# Altium project ThrusterBoard.PrjPcb
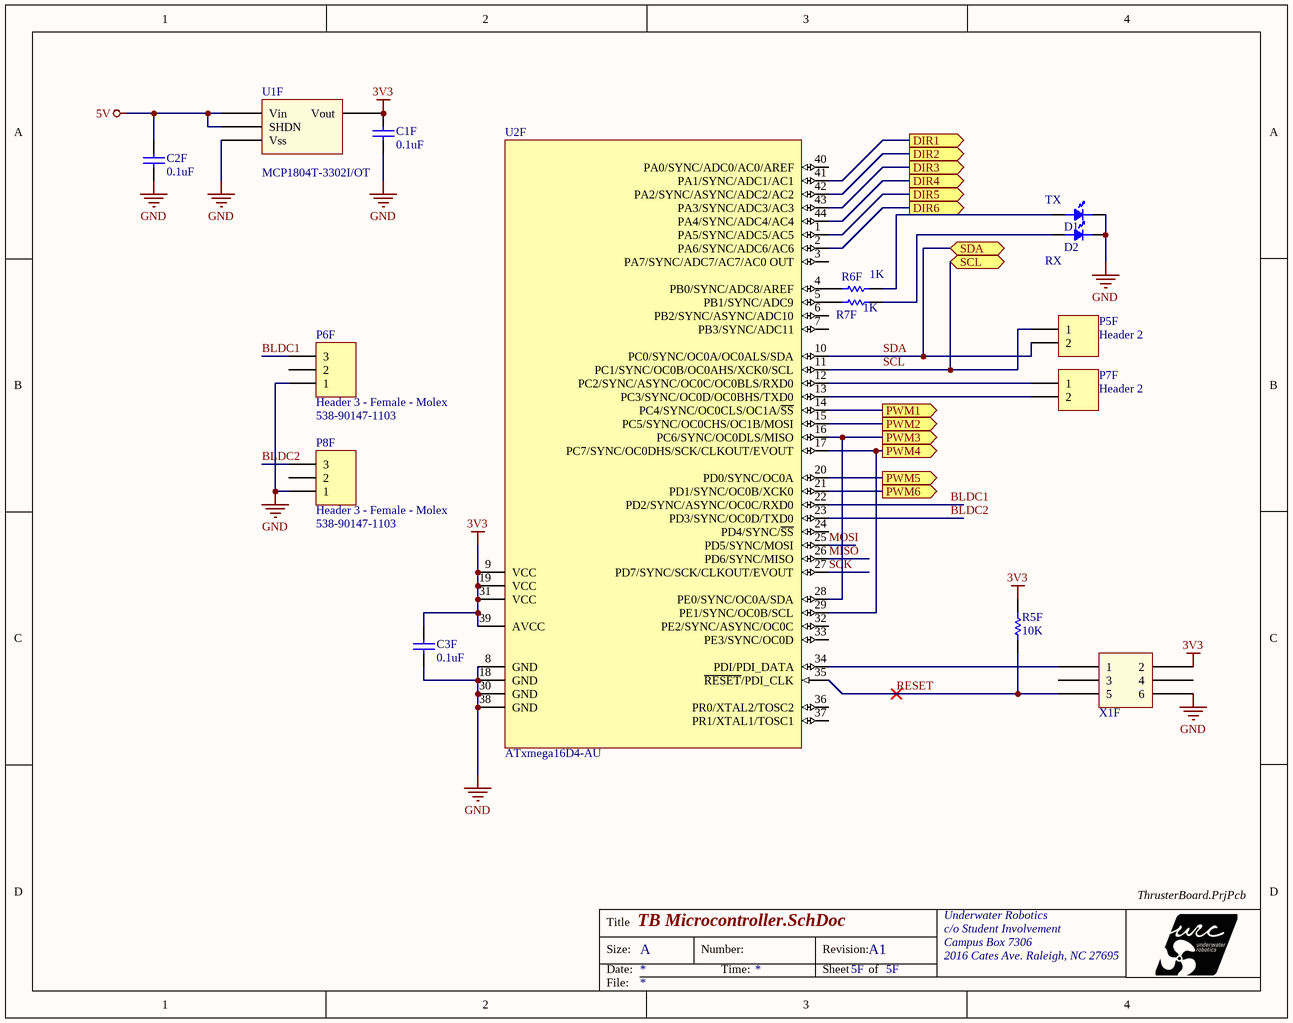
[diagram p0: TB Microcontroller.SchDoc]
1 sheet, 15 parts. Net scope: flat (ports and power ports of the same name join across sheets).
Board file: ThrusterBoard.PcbDoc

## Sheet TB Microcontroller.SchDoc
size A; Organization: Underwater Robotics; Address1: c/o Student Involvement; Address2: Campus Box 7306; Address3: 2016 Cates Ave. Raleigh, NC 27695; Revision: A1; SheetNumber: 5F; SheetTotal: 5F

### Parts
C1F  value 0.1uF  [C0603]  (hidden comment: 0.1uF, C0603, MultiComp)
C2F  value 0.1uF  [C0603]  (hidden comment: 0.1uF, C0603, MultiComp)
C3F  value 0.1uF  [C0603]  (hidden comment: 0.1uF, C0603, MultiComp)
D1  LED  [LED0805]  (value not drawn)
D2  LED  [LED0805]  (value not drawn)
P5F  Header 2  [HDR1X2]
P6F  Header 3 - Female - Molex  Supplier Part Number 1: 538-90147-1103  [HDR1X3 - Female - Molex]
P7F  Header 2  [HDR1X2]
P8F  Header 3 - Female - Molex  Supplier Part Number 1: 538-90147-1103  [HDR1X3 - Female - Molex]
R5F  value 10K  [R0603]  (hidden comment: Resistor)
R6F  value 1K  [R0603]  (hidden comment: Resistor)
R7F  value 1K  [R0603]  (hidden comment: Resistor)
U1F  MCP1804T-3302I/OT  [MCP1804T-3302I/OT]
U2F  ATxmega16D4-AU  [44A_N]
X1F  Header  [2x3 Header]  (value not drawn)

### Ports
DIR1 (out), DIR2 (out), DIR3 (out), DIR4 (out), DIR5 (out), DIR6 (out), PWM1 (out), PWM2 (out), PWM3 (out), PWM4 (out), PWM5 (out), PWM6 (out), SCL (bidir), SDA (bidir)

### Nets
3V3: C1F.1(+) C3F.1(+) R5F.2 U1F.Vout U2F.9(VCC) U2F.19(VCC) U2F.31(VCC) U2F.39(AVCC) X1F.2
5V: C2F.1(+) U1F.SHDN U1F.Vin
GND: C1F.2 C2F.2 C3F.2 D1.1 D2.1 P6F.1 P8F.1 U1F.Vss U2F.8(GND) U2F.18(GND) U2F.30(GND) U2F.38(GND) X1F.6
BLDC1: P6F.3 U2F.22(PD2/SYNC/ASYNC/OC0C/RXD0)
BLDC2: P8F.3 U2F.23(PD3/SYNC/OC0D/TXD0)
MISO: U2F.26(PD6/SYNC/MISO)
MOSI: U2F.25(PD5/SYNC/MOSI)
RESET: R5F.1 U2F.35(~{RESET}/PDI_CLK) X1F.5
SCK: U2F.27(PD7/SYNC/SCK/CLKOUT/EVOUT)
SCL: P5F.1 U2F.11(PC1/SYNC/OC0B/OC0AHS/XCK0/SCL) ; port SCL
SDA: P5F.2 U2F.10(PC0/SYNC/OC0A/OC0ALS/SDA) ; port SDA
NetD1_2: D1.2 R6F.2
NetD2_2: D2.2 R7F.2
NetP7F_1: P7F.1 U2F.12(PC2/SYNC/ASYNC/OC0C/OC0BLS/RXD0)
NetP7F_2: P7F.2 U2F.13(PC3/SYNC/OC0D/OC0BHS/TXD0)
NetR6F_1: R6F.1 U2F.4(PB0/SYNC/ADC8/AREF)
NetR7F_1: R7F.1 U2F.5(PB1/SYNC/ADC9)
NetU2F_1: U2F.1(PA5/SYNC/ADC5/AC5) ; port DIR5
NetU2F_2: U2F.2(PA6/SYNC/ADC6/AC6) ; port DIR6
NetU2F_14: U2F.14(PC4/SYNC/OC0CLS/OC1A/~{SS}) ; port PWM1
NetU2F_15: U2F.15(PC5/SYNC/OC0CHS/OC1B/MOSI) ; port PWM2
NetU2F_16: U2F.16(PC6/SYNC/OC0DLS/MISO) U2F.28(PE0/SYNC/OC0A/SDA) ; port PWM3
NetU2F_17: U2F.17(PC7/SYNC/OC0DHS/SCK/CLKOUT/EVOUT) U2F.29(PE1/SYNC/OC0B/SCL) ; port PWM4
NetU2F_20: U2F.20(PD0/SYNC/OC0A) ; port PWM5
NetU2F_21: U2F.21(PD1/SYNC/OC0B/XCK0) ; port PWM6
NetU2F_34: U2F.34(PDI/PDI_DATA) X1F.1
NetU2F_41: U2F.41(PA1/SYNC/ADC1/AC1) ; port DIR1
NetU2F_42: U2F.42(PA2/SYNC/ASYNC/ADC2/AC2) ; port DIR2
NetU2F_43: U2F.43(PA3/SYNC/ADC3/AC3) ; port DIR3
NetU2F_44: U2F.44(PA4/SYNC/ADC4/AC4) ; port DIR4

Not connected (* = marked no-connect by the designer): P6F 2; P8F 2; U2F 3(PA7/SYNC/ADC7/AC7/AC0_OUT) 6(PB2/SYNC/ASYNC/ADC10) 7(PB3/SYNC/ADC11) 24(PD4/SYNC/~{SS}) 32(PE2/SYNC/ASYNC/OC0C) 33(PE3/SYNC/OC0D) 36(PR0/XTAL2/TOSC2) 37(PR1/XTAL1/TOSC1) 40(PA0/SYNC/ADC0/AC0/AREF); X1F 3 4

### Notes on the sheet
- (near D1) TX
- (near D2) RX
- Title
- Size:
- Date:
- A
- Number:
- Time:
- Revision:
- Sheet
- of
- File:

### Library data of the parts
C1F C2F C3F = 0.1uF, C0603, MultiComp: Ceramic MLCC, Multicompo, X7R Dielectric; Manufacturer Part Number: MC0603B104K500CT; Description 1: MULTICOMP - MC0603B104K500CT - CERAMIC CAPACITOR, 0.1UF, 50V, X7R, 10%, 0603; Product Range: MC Series; Capacitance: 0.1 F; Capacitance Tolerance: 10%; Dielectric Characteristic: X7; Voltage Rating: 50; Ceramic Capacitor Case: 0603 [1608 Metric]; Supplier 1: Newark; Supplier Part Number 1: 06R4927; Manufacturer 1: MULTICOMP; RoHS: YES; Stock 1: 166516; Pricing 1: 1=0.075, 10=0.048, 50=0.027, 100=0.021, 250=0.017, 500=0.015, 1000=0.012 (USD); Packaging: Cut Tape; ComponentLink1URL: http://www.farnell.com/datasheets/1522998.pdf; ComponentLink1Description: http://www.farnell.com/datasheets/1522998.pdf; ComponentLink2URL: /pdfs/datasheets/spc/Ta-1098.pdf; ComponentLink2Description: /pdfs/datasheets/spc/Ta-1098.pdf
P5F P7F = Header 2: Header, 2-Pin; LatestRevisionDate: 17-Jul-2002; LatestRevisionNote: Re-released for DXP Platform.; Publisher: Altium Limited
P6F P8F = Header 3 - Female - Molex: Header, 3-Pin; Manufacturer Part Number: 90147-1103; Current Rating: 3 A; Mounting Angle: Vertical; Number of Positions: 3 Position; Voltage Rating: 350 V; Pitch: 2.54 mm; Supplier 1: Mouser; Manufacturer: Molex; RoHS: RoHS Compliant; Category: Headers & Wire Housings; Stock 1: 5207; Pricing 1: 1=1.26, 100=1.09, 500=0.988, 1000=0.895, 2000=0.734, 5000=0.575, 10000=0.490 (AUD); Accessory Type: -; Contact Plating: Tin; Contact Type: -; Housing Material: Polyester; Number of Rows: 1 Row; Packaging: Tube; Product: Headers; Series: 90147; Termination Style: Through Hole; Type: Socket; Brand: Molex; Contact Material: Phosphor Bronze; Mounting Style: Through Hole; Row Spacing: -; Contact Gender: Socket (Female); Housing Gender: -; Product Category: C-Grid Connectors; Standard Pack Qty: 5760; Tradename: C-Grid; RoHS - Mouser: Y; Minimum Order Quantity: 1; Reeling: False; ComponentLink1URL: http://www.mouser.com/ds/2/276/0901471103_PCB_RECEPTACLES-176816.pdf; ComponentLink1Description: http://www.mouser.com/ds/2/276/0901471103_PCB_RECEPTACLES-176816.pdf
R5F = 10k, 1%, 100mW, Yageo, R0603: Manufacturer 1: YAGEO; Manufacturer Part Number: RC0603FR-1010KL; Tolerance: 1%; Description 1: YAGEO - RC0603FR-1010KL - RES, THICK FILM, 10K, 1%, 0.1W, 0603; Product Range: RC Series; Resistance: 10; Power Rating: 100; Voltage Rating: 50; Resistor Case Style: 0603 [1608 Metric]; Body Length: 1.6; Supplier 1: Newark; Supplier Part Number 1: 68R0120; RoHS: YESX; Stock 1: 7839; Pricing 1: 1=0.002, 10=0.002, 25=0.002, 100=0.002, 250=0.002, 1000=0.002 (USD); Resistance Tolerance: 1%; Packaging: Cut Tape; MSL: -; ComponentLink1URL: http://www.farnell.com/datasheets/1868787.pdf; ComponentLink1Description: http://www.farnell.com/datasheets/1868787.pdf; ComponentLink2URL: http://www.yageo.com/pdf/PYu-RC0603_51_RoHS_L_4.pdf; ComponentLink2Description: http://www.yageo.com/pdf/PYu-RC0603_51_RoHS_L_4.pdf
R6F R7F = 1k, 5%, 100mW, Yageo, R0603: Manufacturer 1: YAGEO; Manufacturer Part Number: RC0603JR-131KL; Tolerance: 5%; Description 1: YAGEO - RC0603JR-131KL - RES, THICK FILM, 1K, 5%, 0.1W, 0603; Product Range: RC Series; Resistance: 1; Power Rating: 100; Voltage Rating: 50; Resistor Case Style: 0603 [1608 Metric]; Body Height: 0.45; Supplier 1: Newark; Supplier Part Number 1: 68R0220; RoHS: YESX; Stock 1: 36430; Pricing 1: 1=0.06, 10=0.011, 25=0.008, 100=0.005, 250=0.003, 1000=0.002 (USD); Resistance Tolerance: 5%; Packaging: Cut Tape; MSL: -; ComponentLink1URL: http://www.farnell.com/datasheets/1868787.pdf; ComponentLink1Description: http://www.farnell.com/datasheets/1868787.pdf; ComponentLink2URL: http://www.yageo.com/pdf/PYu-RC0603_51_RoHS_L_4.pdf; ComponentLink2Description: http://www.yageo.com/pdf/PYu-RC0603_51_RoHS_L_4.pdf
U1F = MCP1804T-3302I/OT: 3.3V Linear Regulator; Manufacturer 1: MICROCHIP; Description 1: MICROCHIP - MCP1804T-3302I/OT - LDO VOLTAGE REGULATOR, 3.3V, 150mA, 5-SOT-23; Input Voltage Min: 2; Input Voltage Max: 28; Output Current: 150; Dropout Voltage Vdo: 260; LDO Regulator Case Style: SOT-23; No. of Pins: 5; URL: http://www.newark.com/microchip/mcp1804t-3302i-ot/ldo-voltage-regulator-3-3v-150ma/dp/55R1047; Supplier 1: Newark; Supplier Part Number 1: 55R1047; RoHS: YES; Stock 1: 12; Pricing 1: 1=0.67, 26=0.56, 100=0.51 (USD); Operating Temperature Min: -40 C; ComponentLink1URL: http://www.farnell.com/datasheets/1789199.pdf; ComponentLink1Description: http://www.farnell.com/datasheets/1789199.pdf; ComponentLink2URL: http://www.farnell.com/cad/1790647.zip; ComponentLink2Description: http://www.farnell.com/cad/1790647.zip; Manufacturer Part Number: MCP1804T-3302I/OT
U2F = ATxmega16D4-AU: 8/16-bit AVR XMEGA D4 Microcontroller, 1.6-3.6V, 32MHz, 16KB + 4KB Flash, 1KB EEPROM, 2KB SRAM, 44-pin TQFP, Industrial Grade (-40°C to 85°C), Pb-Free; Manufacturer 1: ATMEL; Description 1: ATMEL - ATXMEGA16D4-AU - MICROCONTROLLER MCU, 8 BIT, AVR XMEGA, 32MHZ, TQFP-44; CPU Speed: 32; Program Memory Size: 16; RAM Memory Size: 2; No. of Pins: 44; No. of I/O's: 34; Supply Voltage Min: 1.6; DatasheetVersion: revJ, Dec-2010; PackageVersion: revC, Oct-2010; PackageReference: 44A; PackageDescription: 44-Pin Plastic Thin Profile Quad Flat Pack, 10 x 10 x 1.0 mm Body, 0.8 mm Pitch (TQFP); Code_JEDEC: MS-026-ACB; ComponentLink1Description: Manufacturer URL; ComponentLink1URL: http://www.atmel.com/; ComponentLink2Description: ATxmega128D4/64D4/32D4/16D4 Datasheet; ComponentLink2URL: http://www.atmel.com/dyn/resources/prod_documents/doc8135.pdf; Supplier 1: Newark; Supplier Part Number 1: 68T3906; Manufacturer Part Number: ATXMEGA16D4-AU; RoHS: YES; Stock 1: 196; Pricing 1: 1=2.71, 10=2.38, 25=2.24, 50=1.9, 100=1.79, 250=1.72, 500=1.69, 1000=1.49 (USD); Controller Family/Series: ATxmega; MCU Case Style: TQFP; ComponentLink3URL: http://www.farnell.com/datasheets/1693882.pdf; ComponentLink3Description: http://www.farnell.com/datasheets/1693882.pdf; ComponentLink4URL: http://www.farnell.com/cad/1773743.zip; ComponentLink4Description: http://www.farnell.com/cad/1773743.zip; ComponentLink5URL: http://bcove.me/gu8hm7kh; ComponentLink5Description: http://bcove.me/gu8hm7kh
X1F = 2x3 Header: Manufacturer 1: FCI; Manufacturer Part Number: 67996-406HLF; Description 1: FCI - 67996-406HLF - BOARD-BOARD CONNECTOR HEADER, 6 POSITION, 2ROW; Product Range: BergStik 67996 Series; Contact Termination Type: Through Hole; No. of Contacts: 6; Pitch Spacing: 2.54; No. of Rows: 2; Supplier Part Number 1: 20M2191; Supplier 1: Newark; RoHS: YES; Stock 1: 441; Pricing 1: 1=0.254, 10=0.218, 25=0.186, 50=0.178, 100=0.16, 250=0.153, 500=0.128, 1000=0.117 (USD); Gender: Header; Contact Plating: Tin Plated Contacts; ComponentLink1URL: http://www.farnell.com/datasheets/1876884.pdf; ComponentLink1Description: http://www.farnell.com/datasheets/1876884.pdf